# Altium project Function_generator.PrjPcb
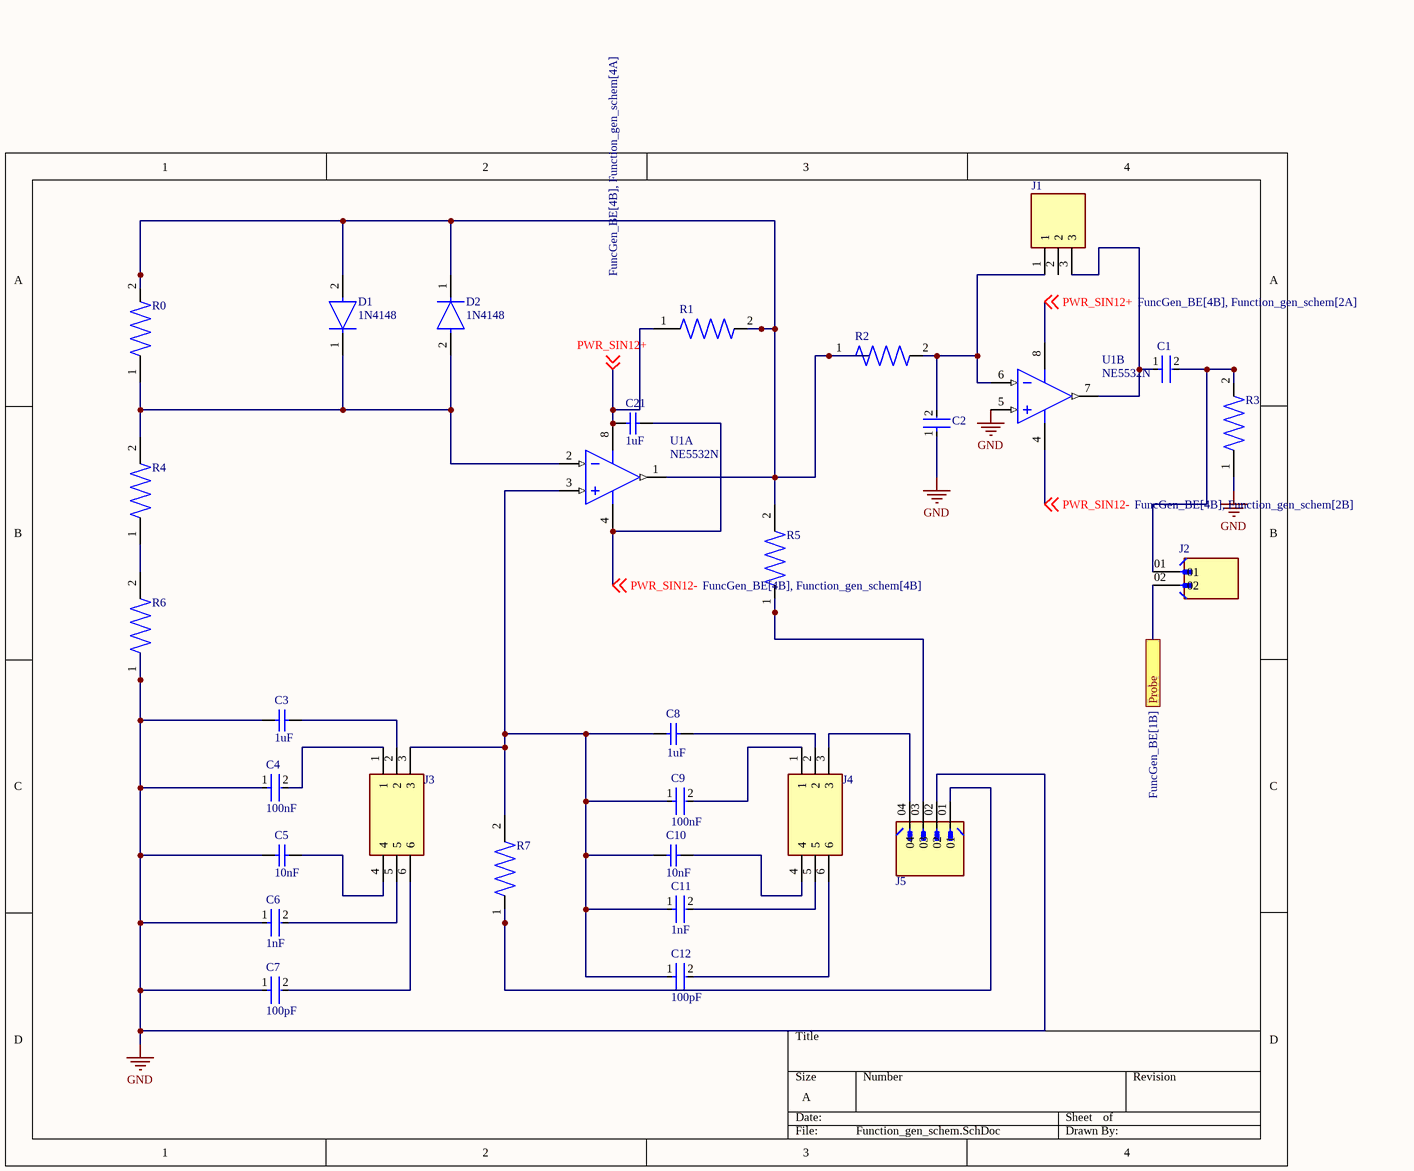
[diagram p0: Function_gen_schem.SchDoc]
3 sheets, 66 parts. Net scope: flat (ports and power ports of the same name join across sheets).
Board file: PCBLAST.PcbDoc
Sheets:
  Function_gen_schem.SchDoc
  FuncGen_ST.SchDoc
  FuncGen_BE.SchDoc

## Sheet Function_gen_schem.SchDoc
size A; SheetNumber: 1; SheetTotal: 3

### Parts
C1  SR205C104KAR  [FP-SR20-MFG]  (value not drawn)
C2  RCE5C1H271J0K1H03B  [FP-RCE0K1-MFG]  (value not drawn)
C3  1uF  [KEMT-C330C105M5U5TA]
C4  100nF  [FP-C322C104K5R5TA-MFG]
C5  10nF  [KEMT-C315-THT-2]
C6  1nF  [FP-DE6_D7_T7_F7_5_d0_6-0-MFG]
C7  100pF  [FP-RCE0K1-MFG]
C8  1uF  [KEMT-C330C105M5U5TA]
C9  100nF  [FP-C322C104K5R5TA-MFG]
C10  10nF  [KEMT-C315-THT-2]
C11  1nF  [FP-DE6_D7_T7_F7_5_d0_6-0-MFG]
C12  100pF  [FP-RCE0K1-MFG]
C21  1uF  [KEMT-C330C105M5U5TA]
D1  1N4148  [FP-017AG-MFG]
D2  1N4148  [FP-017AG-MFG]
J1  3-644456-3  [TE_3-644456-3]  (value not drawn)
J2  861400021YO2LF  [AMPHENOL_861400021YO2LF]  (value not drawn)
J3  4-103327-6  [TE_4-103327-6]  (value not drawn)
J4  4-103327-6  [TE_4-103327-6]  (value not drawn)
J5  77311-102S04LF  [AMPHENOL_77311-102S04LF]  (value not drawn)
R0  3-1623927-1  [RESAD700W45L350D185]  (value not drawn)
R1  3-1623927-1  [RESAD700W45L350D185]  (value not drawn)
R2  3-1623927-1  [RESAD700W45L350D185]  (value not drawn)
R3  3-1623927-1  [RESAD700W45L350D185]  (value not drawn)
R4  3-1623927-1  [RESAD700W45L350D185]  (value not drawn)
R5  3-1623927-1  [RESAD700W45L350D185]  (value not drawn)
R6  3-1623927-1  [RESAD700W45L350D185]  (value not drawn)
R7  3-1623927-1  [RESAD700W45L350D185]  (value not drawn)
U1  NE5532N  [ONSC-PDIP-8-626-05]  (parts A,B of 2)

### Ports
Probe (see FuncGen_BE[1B])

### Nets
GND: C2.1 C3.1 C4.1 C5.1 C6.1 C7.1 J5.02 R3.1 R6.1 U1.5(INB+)
PWR_SIN12+: C21.1 R1.1 U1.8(V+) ; off-sheet PWR_SIN12+
PWR_SIN12-: C21.2 U1.4(V-) ; off-sheet PWR_SIN12-
NetC1_1: C1.1 J1.3 U1.7(OUTB)
NetC1_2: C1.2 J2.01 R3.2
NetC2_2: C2.2 J1.1 R2.2 U1.6(INB-)
NetC3_2: C3.2 J3.2
NetC4_2: C4.2 J3.1
NetC5_2: C5.2 J3.4
NetC6_2: C6.2 J3.5
NetC7_2: C7.2 J3.6
NetC8_1: C8.1 C9.1 C10.1 C11.1 C12.1 J3.3 R7.2 U1.3(INA+)
NetC8_2: C8.2 J4.2
NetC9_2: C9.2 J4.1
NetC10_2: C10.2 J4.4
NetC11_2: C11.2 J4.5
NetC12_2: C12.2 J4.6
NetD1_1: D1.1(C) D2.2(A) R0.1 R4.2 U1.2(INA-)
NetD1_2: D1.2(A) D2.1(C) R0.2 R1.2 R2.1 R5.2 U1.1(OUTA)
NetJ2_02: J2.02 ; port Probe
NetJ4_3: J4.3 J5.04
NetJ5_01: J5.01 R7.1
NetJ5_03: J5.03 R5.1
NetR4_1: R4.1 R6.2

Not connected (* = marked no-connect by the designer): J1 2

### Library data of the parts
C1 = CMP-04427-000013-1: CAP CER 0.1UF 50V X7R RADIAL; Manufacturer: AVX; Material: Ceramic; Tolerance: 10%; Capacitance: 100nF; Value: 100nF; Voltage: 50V; Height: 5.08mm; Digikey Description: CAP CER 0.1UF 50V X7R RADIAL; Device Class L2: Capacitors; ComponentLink2URL: http://datasheets.avx.com/SR-Series.pdf; Temperature Range High: +125°C; Lead Free: Yes; Manufacturer Part Number: SR205C104KAR; Category: Cap; Device Class L1: Passive Components; Temperature: -55°C to +125°C; Voltage Rating: 50V; ComponentLink2Description: Datasheet; RoHS: TRUE; Automotive: No; Octopart: https://octopart.com/sr205c104kar-avx-145048; Mouser Description: Multilayer Ceramic Capacitors MLCC - Leaded 50volts 0.1uF 10% X7R; Temperature Characteristic: X7R; Device Class L3: Ceramic Capacitors; Temperature Range Low: -55°C; Package: SR20
C2 = CMP-06035-042310-1: Cap Ceramic 270pF 50V C0G ±5% Radial 5mm +125°C Automotive Bulk; Lead Diameter: 0.5mm; Lead/Base Style: Formed Leads; Height: 3.5mm; Max Operating Temperature: 125°C; Length: 0.142inch; Tolerance: 5%; Lead Pitch: 0.197inch; Mount: Through Hole; Width: 2.5mm; Dielectric: C0G; Packaging: Bulk; Voltage Rating: 50V; Resistor Type: Ceramic; Capacitance: 270pF; Case/Package: Radial; Height - Seated (Max): 0.138inch; Package Quantity: 500; Min Operating Temperature: -55°C; Voltage Rating (DC): 50V; Ratings: AEC-Q200; Termination: Radial
C3 C8 C21 = CMP-2000-06056-1: Ceramic Capacitor, 1 uF, +/- 20%, 50 V, -10 to 85 degC, 2-Pin THD, RoHS, Bulk; Manufacturer: Kemet; Voltage - Rated: 50V; Temperature Coefficient: Z5U; Catalog Drawings: C330(std); Product Training Modules: CapacitorBasics-TypicalUsesforCapacitors; Capacitance: 1µF; Online Catalog: GoldenMax™Series; Other Names: 399-4390; PCN Design/Specification: C3yySeriesGoldenMaxLeadConfiguration02/Feb/2015; Thickness (Max): -; Size / Dimension: 0.300"Lx0.150"W(7.62mmx3.81mm); Mounting Technology: ThroughHole; Tolerance: ±20%; Mounting Type: ThroughHole; Datasheet URL: http://www.kemet.com/Lists/ProductCatalog/Attachments/599/KEM_C1051_GOLDMAX_Z5U.pdf; Series: GoldenMax™; Standard Package: 250; Ratings: -; Applications: GeneralPurpose; Package Reference: C330C105M5U5TA; Packaging: Bulk; Category: Capacitors; Package Description: 2-Pin Through Hole Device, Body 7.11 x 4.07 mm; Operating Temperature: 10°C~85°C; Height - Seated (Max): 0.360"(9.14mm); Manufacturer URL: http://www.kemet.com/; Lead Spacing: 0.200"(5.08mm); Features: -; Lead Style: Straight; Package / Case: Radial; Family: CeramicCapacitors; Datasheet Version: 12/2015
C4 C9 = CMP-03020-034661-1: CAP CER 0.1UF 50V X7R RADIAL; Dielectric Material: Ceramic; Dissipation Factor: 2.5%; Lead Length: 7mm; Tolerance: 10%; Lead Diameter: 0.51mm; Lead/Base Style: Formed Leads; Capacitance: 100nF; Construction: RADIAL; RoHS Compliant: Yes; Voltage Rating (DC): 50V; Packaging: Bulk; Lead Free: Lead Free; Width: 0.125inch; Lead Pitch: 5.08mm; Voltage Rating: 50V; Number of Pins: 2; Radiation Hardening: No; Material: Ceramic; REACH SVHC: No SVHC; Height - Seated (Max): 0.26inch; Case/Package: Radial; Weight: 0.0625lb; Dielectric: X7R; Min Operating Temperature: -55°C; Voltage: 50V; Series: Golden Max™; Max Operating Temperature: 125°C; Height: 3.18mm; Termination: Radial; Length: 5.08mm; Depth: 3.18mm; Package Quantity: 500; Mount: Through Hole
C5 C10 = CMP-1664-00007-1: Capacitor, Ceramic, 0.01 uF, +/- 10%, 100 V, X7R, -55 to 125 degC, 2-Pin THD, RoHS, Bulk; Output Voltage: 70 V; Case\Package: PDIP; Forward Current: 60 mA; Nominal Vf: 1.3 V; Forward Voltage: 1.5 V; Channels: 2; Max Power Dissipation: 400 mW; Vce Max: 500 mV; ComponentLink1Description: Manufacturer URL; ComponentLink2Description: Datasheet; Packaging: Rail/Tube; RoHSCompliant: true; Package Quantity: 2000; PackageReference: C315-THT-2; Min Operating Temperature: -55 degC; Max Operating Temperature: 100 degC; Radiation Hardening: No; ComponentLink1URL: http://www.kemet.com/; DatasheetVersion: Aug-16; Pins: 16; PackageDescription: 2-Pin Through Hole Device, Body 3.81 x 2.54 mm; REACH SVHC: Unknown; Mount: Through Hole; ComponentLink2URL: http://capacitoredge.kemet.com/capedge2/DataSheet/Datasheet-C315C103K1R5TA.pdf?pn=C315C103K1R5TA{BULK}
C6 C11 = CMP-06035-062244-1: CAP CER 1000PF 300VAC RADIAL; Lead/Base Style: Formed Leads; Material: Ceramic; Tolerance: 20%; Lead Diameter: 0.6mm; Voltage Rating (AC): 300V; Termination: Radial; RoHS Compliant: Yes; Width: 7mm; Package Quantity: 700; Lead Pitch: 7.5mm; Capacitance: 1nF; Case/Package: Radial; Resistor Type: Ceramic; Ratings: AEC-Q200; Series: KJ; Depth: 7mm; Min Operating Temperature: -25°C; Height - Seated (Max): 0.394inch; Mount: Through Hole; REACH SVHC: No SVHC; Max Operating Temperature: 125°C; Packaging: Bulk
C7 C12 = CMP-06035-040252-1: Cap Ceramic 100pF 50V C0G ±5% Radial 5mm +125°C Automotive Bulk; Lead Diameter: 0.5mm; Lead/Base Style: Formed Leads; Mount: Through Hole; Height: 3.5mm; Voltage Rating: 50V; Lead Pitch: 0.197inch; Packaging: Bulk; Capacitance: 100pF; Height - Seated (Max): 0.138inch; Length: 0.142inch; Max Operating Temperature: 125°C; Resistor Type: Ceramic; Case/Package: Radial; Package Quantity: 500; Voltage Rating (DC): 50V; Tolerance: 5%; Width: 2.5mm; Termination: Radial; Ratings: AEC-Q200; Dielectric: C0G; Min Operating Temperature: -55°C
D1 D2 = CMP-07163-000046-1: DIODE GEN PURP 100V 200MA DO35; Forward Voltage: 1V; Max Power Dissipation: 500mW; Max Reverse Current: 5uA; Forward Current: 300mA; Current: 4A; Reverse Recovery Time: 4ns; Element Configuration: Single; Outside Diameter: 1.85mm; Capacitance: 4pF; Polarity: Standard; Max Forward Surge Current (Ifsm): 1A; Reverse Voltage: 100V; Output Current: 200mA; Average Rectified Current: 200mA; Diameter: 1.91mm; Max Repetitive Reverse Voltage (Vrrm): 100V; Current Rating: 200mA; Case/Package: DO-35; Lead Free: Lead Free; Number of Pins: 2; Recovery Time: 4ns; Packaging: Bulk; Contact Plating: Tin; Voltage: 100V; Mount: Through Hole; Max Surge Current: 4A; Package Quantity: 2000; Width: 1.91mm; Max Reverse Voltage (DC): 100V; Length: 4.56mm; Radiation Hardening: No; Power Dissipation: 500mW; Voltage Rating (DC): 100V; Peak Non-Repetitive Surge Current: 4A; REACH SVHC: No SVHC; Height: 4.56mm; Max Operating Temperature: 175°C; Series: -; Weight: 0.01lb; Min Operating Temperature: -65°C
J1 = 3-644456-3: MTA-100 3 Position Through-Hole Single Row Straight Wire to Board Header; Centerline_Pitch: 2.54 mm[.1 in]; Product_Type: Connector; MF: TE Connectivity; Number_of_Positions: 3; MP: 3-644456-3; Price: None; Package: None; Availability: Unavailable; SnapEDA_Link: https://www.snapeda.com/parts/3-644456-3/TE%20Connectivity%20AMP%20Connectors/view-part/2772999/?ref=snap; Value: *; TE_purchase_URL: https://www.te.com/usa-en/product-3-644456-3.html?te_bu=Cor&te_type=disp&te_campaign=seda_glo_cor-seda-global-disp-prtnr-fy19-seda-model-bom-cta_sma-317_1&elqCampaignId=32493
J2 = 861400021YO2LF: Board to Board connector, Unshrouded Header, Through Hole, Single Row, 2 Position, Vertical.; MF: Amphenol ICC (FCI); Value: *; SnapEDA_Link: https://www.snapeda.com/parts/861400021YO2LF/Amphenol+FCI/view-part/?ref=snap; Purchase-URL: https://pricing.snapeda.com/search/part/861400021YO2LF/?ref=eda; Availability: In Stock; Price: None; Package: None; Check_prices: https://www.snapeda.com/parts/861400021YO2LF/Amphenol+FCI/view-part/?ref=eda; MP: 861400021YO2LF
J3 J4 = 4-103327-6: 6 Position Single Row 2.54 mm Through-Hole Straight AMPMODU Breakaway Header; Centerline_Pitch: 2.54 mm[.1 in]; MF: TE Connectivity; Product_Type: Connector; Number_of_Positions: 6; SnapEDA_Link: https://www.snapeda.com/parts/4-103327-6/TE%20Connectivity%20AMP%20Connectors/view-part/2779147/?ref=snap; TE_purchase_URL: https://www.te.com/usa-en/product-4-103327-6.html?te_bu=Cor&te_type=disp&te_campaign=seda_glo_cor-seda-global-disp-prtnr-fy19-seda-model-bom-cta_sma-317_1&elqCampaignId=32493; Availability: Unavailable; Price: None; MP: 4-103327-6; Package: None; Value: *
J5 = 77311-102S04LF: BergStikÂ® 2.54mm, Board To Board, Unshrouded Header, 2.54 mm Pitch, Vertical, Single Row,Through Hole, 4 positions.; MF: Amphenol ICC (FCI); Purchase-URL: https://pricing.snapeda.com/search/part/77311-102S04LF/?ref=eda; Package: None; Value: *; Check_prices: https://www.snapeda.com/parts/77311-102S04LF/Amphenol+FCI/view-part/?ref=eda; SnapEDA_Link: https://www.snapeda.com/parts/77311-102S04LF/Amphenol+FCI/view-part/?ref=snap; Availability: In Stock; Price: None; MP: 77311-102S04LF
R0-R7 = 3-1623927-1: 1 MOhms Â±5% 0.25W, 1/4W Through Hole Resistor Axial - Carbon Film; MF: TE Connectivity; Price: None; SnapEDA_Link: https://www.snapeda.com/parts/3-1623927-1/TE+Connectivity/view-part/?ref=snap; Check_prices: https://www.snapeda.com/parts/3-1623927-1/TE+Connectivity/view-part/?ref=eda; Value: *; MP: 3-1623927-1; Package: None; Availability: In Stock
U1 = CMP-1310-00070-1: Internally Compensated Dual Low Noise Operational Amplifier, 6 to 40 V, 0 to 70 degC, 8-Pin PDIP, Tube; Manufacturer: On Semiconductor; VCC Min (V): 6; VCC Max (V): 40; GBW Typ (MHz): 10; SR Typ (V/uS): 9; Mounting Technology: Through Hole; PackageVersion: Rev. N, 06/2013; PartNumber: NE5532N; PackageDescription: 8-Pin Plastic Dual-In Line Package, Body 9.59 x 6.605 mm, Pitch 2.54 mm; ComponentLink3URL: http://www.onsemi.cn/pub_link/Collateral/626-05.PDF; PackageReference: PDIP-8-626-05; ComponentLink2Description: Datasheet; ComponentLink3Description: Package Specification; RoHS: FALSE; ComponentLink1URL: http://www.onsemi.com/; ComponentLink1Description: Manufacturer URL; ComponentLink2URL: http://www.onsemi.cn/pub_link/Collateral/NE5532-D.PDF; Packing: Tube; DatasheetVersion: Rev. 2

## Sheet FuncGen_ST.SchDoc
size A; SheetNumber: 2; SheetTotal: 3
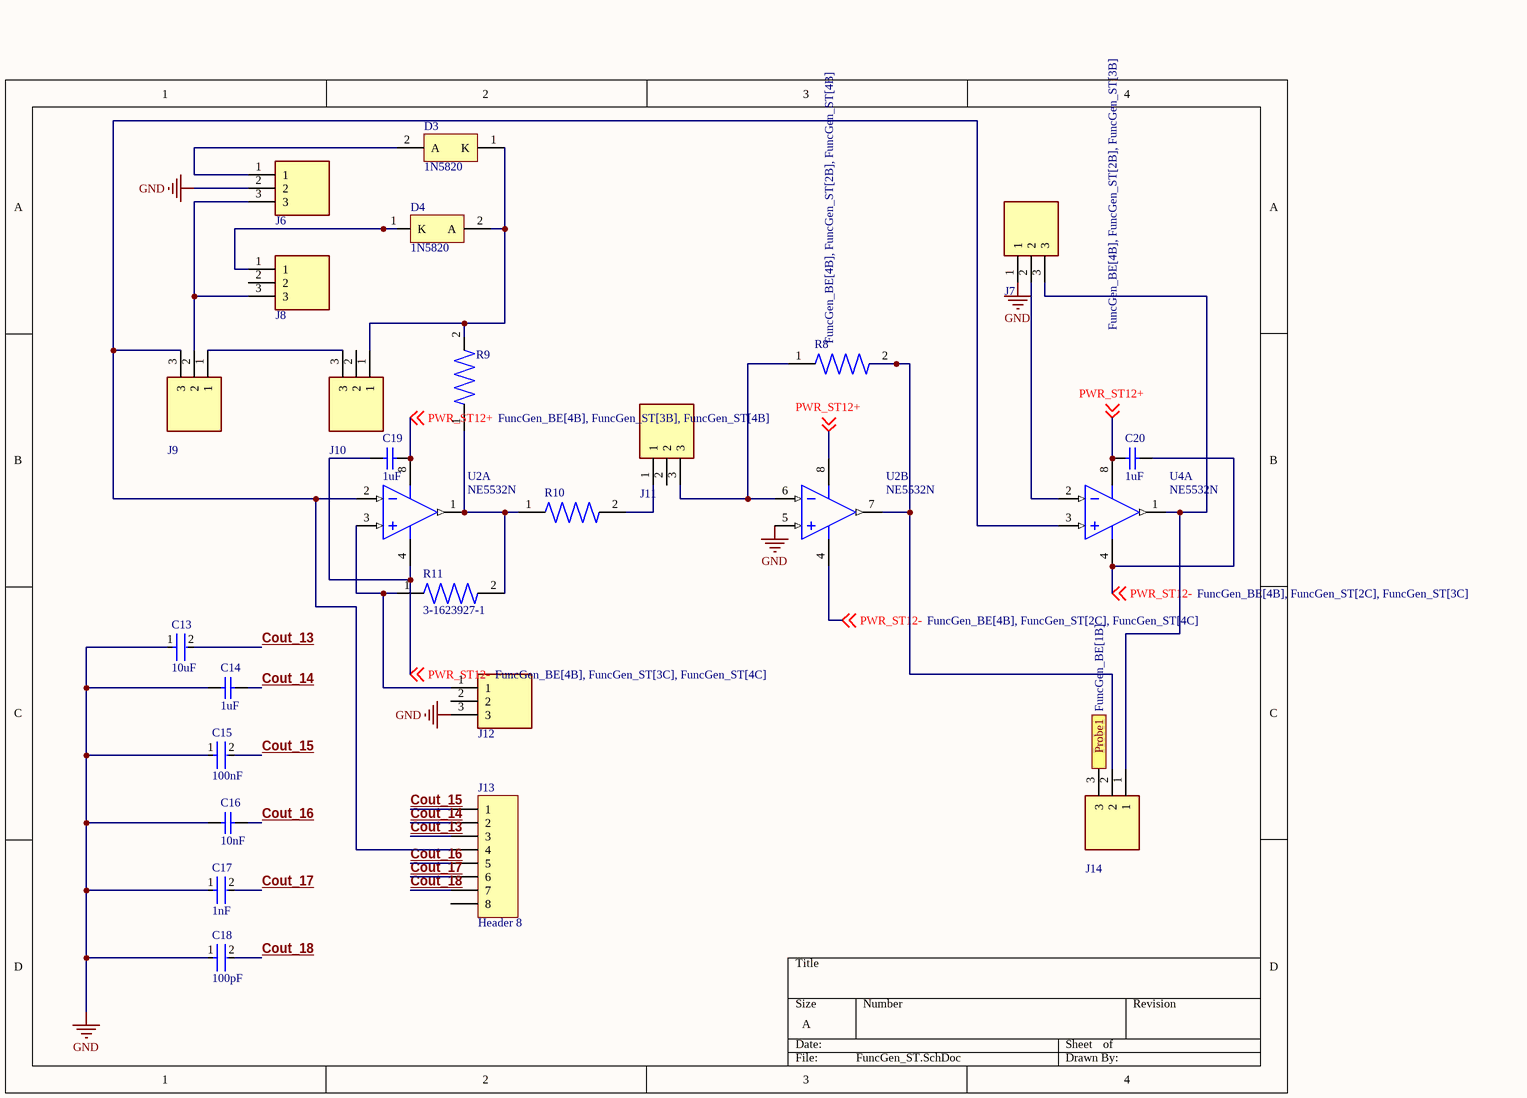
[diagram p1: FuncGen_ST.SchDoc]

### Parts
C13  10uF  [FP-RCE3M1-MFG]
C14  1uF  [KEMT-C330C105M5U5TA]
C15  100nF  [FP-C322C104K5R5TA-MFG]
C16  10nF  [KEMT-C315-THT-2]
C17  1nF  [FP-DE6_D7_T7_F7_5_d0_6-0-MFG]
C18  100pF  [FP-RCE0K1-MFG]
C19  1uF  [KEMT-C330C105M5U5TA]
C20  1uF  [KEMT-C330C105M5U5TA]
D3  1N5820  [ONSC-AXIAL_LEAD-2-267-05_V]
D4  1N5820  [ONSC-AXIAL_LEAD-2-267-05_V]
J6  3-644456-3  [TE_3-644456-3]  (value not drawn)
J7  3-644456-3  [TE_3-644456-3]  (value not drawn)
J8  3-644456-3  [TE_3-644456-3]  (value not drawn)
J9  3-644456-3  [TE_3-644456-3]  (value not drawn)
J10  3-644456-3  [TE_3-644456-3]  (value not drawn)
J11  3-644456-3  [TE_3-644456-3]  (value not drawn)
J12  3-644456-3  [TE_3-644456-3]  (value not drawn)
J13  Header 8  [HDR1X8]
J14  3-644456-3  [TE_3-644456-3]  (value not drawn)
R8  3-1623927-1  [RESAD700W45L350D185]  (value not drawn)
R9  3-1623927-1  [RESAD700W45L350D185]  (value not drawn)
R10  3-1623927-1  [RESAD700W45L350D185]  (value not drawn)
R11  3-1623927-1  [RESAD700W45L350D185]
U2  NE5532N  [ONSC-PDIP-8-626-05]  (parts A,B of 2)
U4  NE5532N  [ONSC-PDIP-8-626-05]  (part A of 2)

### Ports
Probe1 (see FuncGen_BE[1B])

### Nets
GND: C13.1 C14.1 C15.1 C16.1 C17.1 C18.1 J6.2 J7.1 J12.3 U2.5(INB+)
Cout_13: C13.2 J13.3
Cout_14: C14.2 J13.2
Cout_15: C15.2 J13.1
Cout_16: C16.2 J13.5
Cout_17: C17.2 J13.6
Cout_18: C18.2 J13.7
PWR_ST12+: C19.2 C20.1 U2.8(V+) U4.8(V+) ; off-sheet PWR_ST12+
PWR_ST12-: C19.1 C20.2 U2.4(V-) U4.4(V-) ; off-sheet PWR_ST12-
NetD3_1: D3.1(K) D4.2(A) J10.1 R9.2
NetD3_2: D3.2(A) J6.1
NetD4_1: D4.1(K) J8.1
NetJ2_02: J14.3 ; port Probe1
NetJ6_3: J6.3 J8.3 J9.2
NetJ7_2: J7.2 U4.2(INA-)
NetJ7_3: J7.3 J14.1 U4.1(OUTA)
NetJ9_1: J9.1 J10.3
NetJ9_3: J9.3 J13.4 U2.2(INA-) U4.3(INA+)
NetJ11_1: J11.1 R10.2
NetJ11_3: J11.3 R8.1 U2.6(INB-)
NetJ12_1: J12.1 R11.1 U2.3(INA+)
NetJ14_2: J14.2 R8.2 U2.7(OUTB)
NetR9_1: R9.1 R10.1 R11.2 U2.1(OUTA)

Not connected (* = marked no-connect by the designer): J8 2; J10 2; J11 2; J12 2; J13 8

### Library data of the parts
C13 = CMP-06035-005744-1: Cap Ceramic 10uF 25V X7R ±10% Radial 5mm +125°C Automotive Ammo Pack; Lead/Base Style: Formed Leads; Lead Diameter: 0.5mm; Length: 0.217inch; Package Quantity: 1500; Width: 0.157inch; Resistor Type: Ceramic; Height - Seated (Max): 0.197inch; Ratings: AEC-Q200; Lead Pitch: 0.197inch; Packaging: Tape and Reel; Tolerance: 10%; Voltage Rating (DC): 25V; Capacitance: 10uF; Termination: Radial; Mount: Through Hole; Voltage Rating: 25V; Min Operating Temperature: -55°C; Height: 5mm; Dielectric: X7R; Max Operating Temperature: 125°C; Case/Package: Radial
C14 C19 C20 = CMP-2000-06056-1: as C3 on sheet Function_gen_schem; Thickness (Max): -; Size / Dimension: 0.300"Lx0.150"W(7.62mmx3.81mm); Mounting Technology: ThroughHole; Tolerance: ±20%; Mounting Type: ThroughHole; Datasheet URL: http://www.kemet.com/Lists/ProductCatalog/Attachments/599/KEM_C1051_GOLDMAX_Z5U.pdf; Series: GoldenMax™; Standard Package: 250; Ratings: -; Applications: GeneralPurpose; Package Reference: C330C105M5U5TA; Packaging: Bulk; Category: Capacitors; Package Description: 2-Pin Through Hole Device, Body 7.11 x 4.07 mm; Operating Temperature: 10°C~85°C; Height - Seated (Max): 0.360"(9.14mm); Manufacturer URL: http://www.kemet.com/; Lead Spacing: 0.200"(5.08mm); Features: -; Lead Style: Straight; Package / Case: Radial; Family: CeramicCapacitors; Datasheet Version: 12/2015
C15 = CMP-03020-034661-1: as C4 on sheet Function_gen_schem; Capacitance: 100nF; Construction: RADIAL; RoHS Compliant: Yes; Voltage Rating (DC): 50V; Packaging: Bulk; Lead Free: Lead Free; Width: 0.125inch; Lead Pitch: 5.08mm; Voltage Rating: 50V; Number of Pins: 2; Radiation Hardening: No; Material: Ceramic; REACH SVHC: No SVHC; Height - Seated (Max): 0.26inch; Case/Package: Radial; Weight: 0.0625lb; Dielectric: X7R; Min Operating Temperature: -55°C; Voltage: 50V; Series: Golden Max™; Max Operating Temperature: 125°C; Height: 3.18mm; Termination: Radial; Length: 5.08mm; Depth: 3.18mm; Package Quantity: 500; Mount: Through Hole
C16 = CMP-1664-00007-1: as C5 on sheet Function_gen_schem; ComponentLink1Description: Manufacturer URL; ComponentLink2Description: Datasheet; Packaging: Rail/Tube; RoHSCompliant: true; Package Quantity: 2000; PackageReference: C315-THT-2; Min Operating Temperature: -55 degC; Max Operating Temperature: 100 degC; Radiation Hardening: No; ComponentLink1URL: http://www.kemet.com/; DatasheetVersion: Aug-16; Pins: 16; PackageDescription: 2-Pin Through Hole Device, Body 3.81 x 2.54 mm; REACH SVHC: Unknown; Mount: Through Hole; ComponentLink2URL: http://capacitoredge.kemet.com/capedge2/DataSheet/Datasheet-C315C103K1R5TA.pdf?pn=C315C103K1R5TA{BULK}
C17 = CMP-06035-062244-1: as C6 on sheet Function_gen_schem; Termination: Radial; RoHS Compliant: Yes; Width: 7mm; Package Quantity: 700; Lead Pitch: 7.5mm; Capacitance: 1nF; Case/Package: Radial; Resistor Type: Ceramic; Ratings: AEC-Q200; Series: KJ; Depth: 7mm; Min Operating Temperature: -25°C; Height - Seated (Max): 0.394inch; Mount: Through Hole; REACH SVHC: No SVHC; Max Operating Temperature: 125°C; Packaging: Bulk
C18 = CMP-06035-040252-1: as C7 on sheet Function_gen_schem; Mount: Through Hole; Height: 3.5mm; Voltage Rating: 50V; Lead Pitch: 0.197inch; Packaging: Bulk; Capacitance: 100pF; Height - Seated (Max): 0.138inch; Length: 0.142inch; Max Operating Temperature: 125°C; Resistor Type: Ceramic; Case/Package: Radial; Package Quantity: 500; Voltage Rating (DC): 50V; Tolerance: 5%; Width: 2.5mm; Termination: Radial; Ratings: AEC-Q200; Dielectric: C0G; Min Operating Temperature: -55°C
D3 D4 = CMP-1055-00030-1: Rectifier, 2-Pin Axial_Lead, Bulk Bag; Manufacturer: On Semiconductor; Note1: 0; IFSM Max (A): 80; Configuration: Single; PackageReference: AXIAL_LEAD-2-267-05; ComponentLink3URL: http://www.onsemi.com/pub_link/Collateral/267-05.PDF; ComponentLink1Description: Manufacturer URL; PartNumber: 1N5820; ComponentLink2URL: http://www.onsemi.cn/pub_link/Collateral/1N5820-D.PDF; DatasheetVersion: Rev. 10; PackageVersion: Rev. G, 06/2000; ComponentLink2Description: Datasheet; Packing: Bulk Bag; PackageDescription: 2-Pin, Axial Lead, Diameter 5.05 mm; Mounting Technology: Through Hole; ComponentLink1URL: http://www.onsemi.com/; ComponentLink3Description: Package Specification; RoHS: FALSE
J6-J12 J14 = 3-644456-3: as J1 on sheet Function_gen_schem; MP: 3-644456-3; Price: None; Package: None; Availability: Unavailable; SnapEDA_Link: https://www.snapeda.com/parts/3-644456-3/TE%20Connectivity%20AMP%20Connectors/view-part/2772999/?ref=snap; Value: *; TE_purchase_URL: https://www.te.com/usa-en/product-3-644456-3.html?te_bu=Cor&te_type=disp&te_campaign=seda_glo_cor-seda-global-disp-prtnr-fy19-seda-model-bom-cta_sma-317_1&elqCampaignId=32493
J13 = Header 8: Header, 8-Pin; LatestRevisionDate: 17-Jul-2002; LatestRevisionNote: Re-released for DXP Platform.; Publisher: Altium Limited
R8-R11 = 3-1623927-1: as R0 on sheet Function_gen_schem; Price: None; SnapEDA_Link: https://www.snapeda.com/parts/3-1623927-1/TE+Connectivity/view-part/?ref=snap; Check_prices: https://www.snapeda.com/parts/3-1623927-1/TE+Connectivity/view-part/?ref=eda; Value: *; MP: 3-1623927-1; Package: None; Availability: In Stock
U2 U4 = CMP-1310-00070-1: as U1 on sheet Function_gen_schem; Mounting Technology: Through Hole; PackageVersion: Rev. N, 06/2013; PartNumber: NE5532N; PackageDescription: 8-Pin Plastic Dual-In Line Package, Body 9.59 x 6.605 mm, Pitch 2.54 mm; ComponentLink3URL: http://www.onsemi.cn/pub_link/Collateral/626-05.PDF; PackageReference: PDIP-8-626-05; ComponentLink2Description: Datasheet; ComponentLink3Description: Package Specification; RoHS: FALSE; ComponentLink1URL: http://www.onsemi.com/; ComponentLink1Description: Manufacturer URL; ComponentLink2URL: http://www.onsemi.cn/pub_link/Collateral/NE5532-D.PDF; Packing: Tube; DatasheetVersion: Rev. 2

## Sheet FuncGen_BE.SchDoc
size A; SheetNumber: 3; SheetTotal: 3
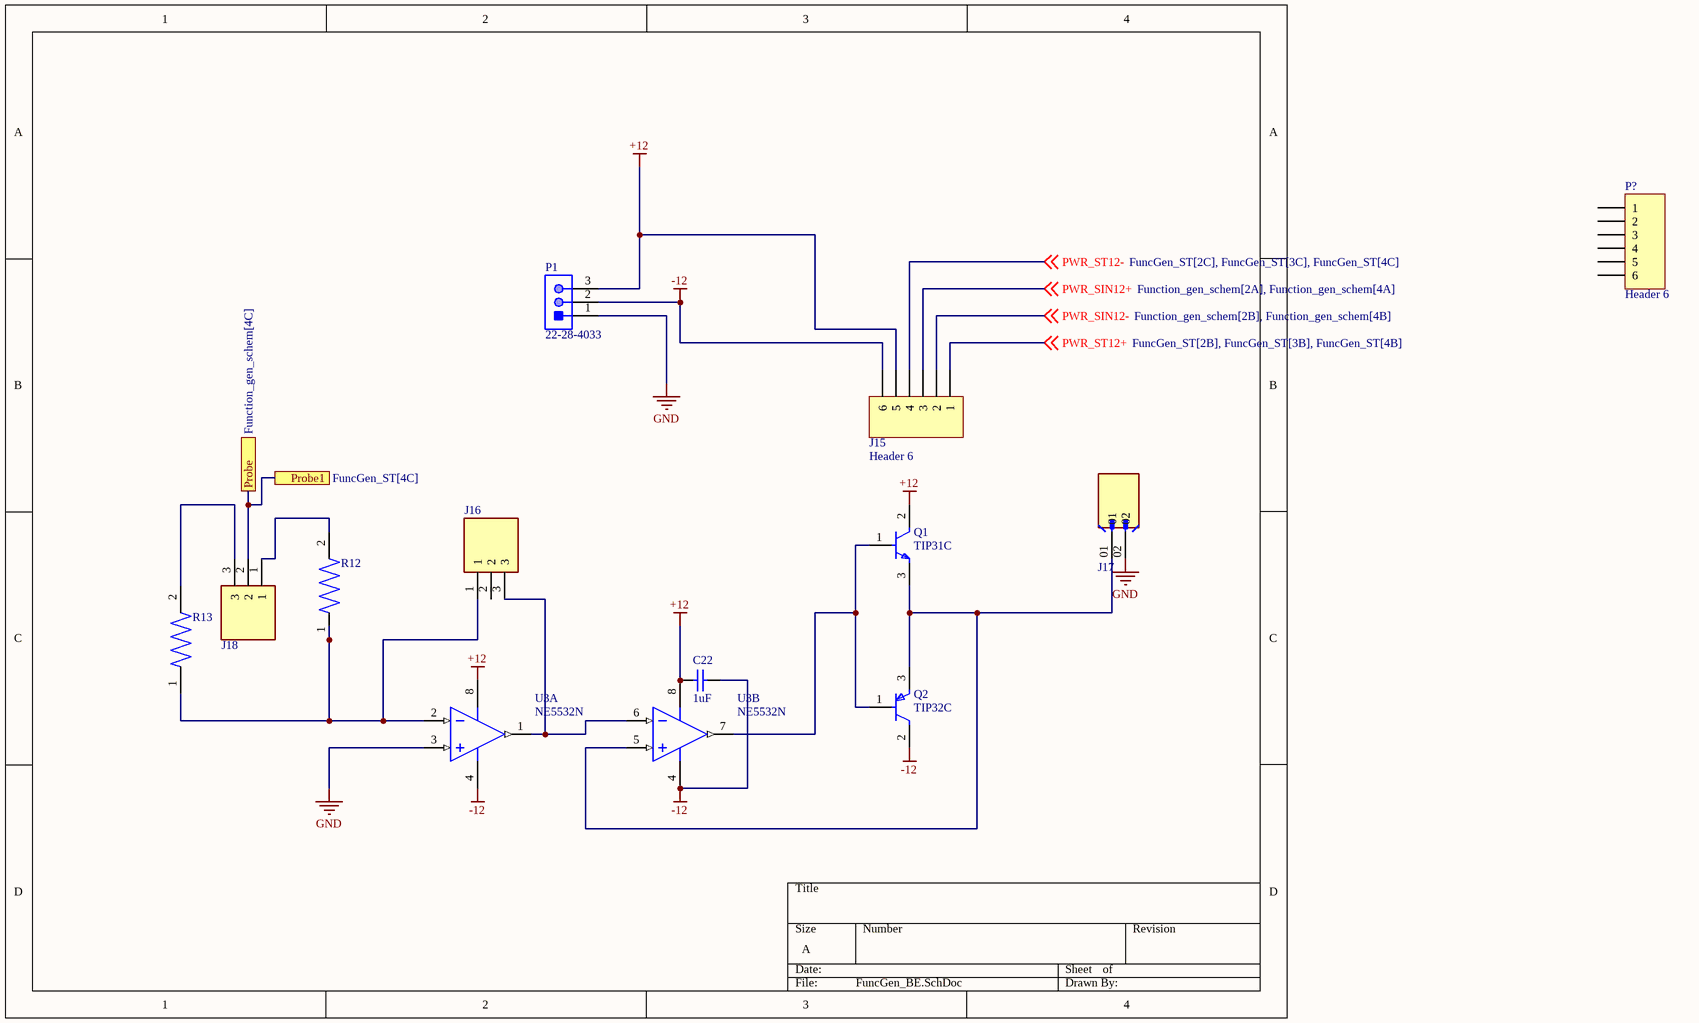
[diagram p2: FuncGen_BE.SchDoc]

### Parts
C22  1uF  [KEMT-C330C105M5U5TA]
J15  Header 6  [HDR1X6]
J16  3-644456-3  [TE_3-644456-3]  (value not drawn)
J17  861400021YO2LF_SWITCH  [AMPHENOL_861400021YO2LF]  (value not drawn)
J18  3-644456-3  [TE_3-644456-3]  (value not drawn)
P1  22-28-4033  [MOLX-22-28-4033_V]
P?  Header 6  [HDR1X6]
Q1  TIP31C  [FP-TO-220-P0A0015988-MFG]
Q2  TIP32C  [FP-TO-220-P0A0015988-MFG]
R12  3-1623927-1  [RESAD700W45L350D185]  (value not drawn)
R13  3-1623927-1  [RESAD700W45L350D185]  (value not drawn)
U3  NE5532N  [ONSC-PDIP-8-626-05]  (parts A,B of 2)

### Ports
Probe1 (see FuncGen_ST[4C]), Probe (see Function_gen_schem[4C])

### Nets
+12: C22.1 J15.5 P1.3 Q1.2(C) U3.8(V+)
-12: C22.2 J15.6 P1.2 Q2.2(C) U3.4(V-)
GND: J17.02 P1.1 U3.3(INA+)
PWR_SIN12+: J15.3 ; off-sheet PWR_SIN12+
PWR_SIN12-: J15.2 ; off-sheet PWR_SIN12-
PWR_ST12+: J15.1 ; off-sheet PWR_ST12+
PWR_ST12-: J15.4 ; off-sheet PWR_ST12-
NetJ2_02: J18.2 ; port Probe, port Probe1
NetJ16_1: J16.1 R12.1 R13.1 U3.2(INA-)
NetJ16_3: J16.3 U3.1(OUTA) U3.6(INB-)
NetJ17_01: J17.01 Q1.3(E) Q2.3(E) U3.5(INB+)
NetJ18_1: J18.1 R12.2
NetJ18_3: J18.3 R13.2
NetQ1_1: Q1.1(B) Q2.1(B) U3.7(OUTB)

Not connected (* = marked no-connect by the designer): J16 2; P? 1 2 3 4 5 6

### Library data of the parts
C22 = CMP-2000-06056-1: as C3 on sheet Function_gen_schem; Thickness (Max): -; Size / Dimension: 0.300"Lx0.150"W(7.62mmx3.81mm); Mounting Technology: ThroughHole; Tolerance: ±20%; Mounting Type: ThroughHole; Datasheet URL: http://www.kemet.com/Lists/ProductCatalog/Attachments/599/KEM_C1051_GOLDMAX_Z5U.pdf; Series: GoldenMax™; Standard Package: 250; Ratings: -; Applications: GeneralPurpose; Package Reference: C330C105M5U5TA; Packaging: Bulk; Category: Capacitors; Package Description: 2-Pin Through Hole Device, Body 7.11 x 4.07 mm; Operating Temperature: 10°C~85°C; Height - Seated (Max): 0.360"(9.14mm); Manufacturer URL: http://www.kemet.com/; Lead Spacing: 0.200"(5.08mm); Features: -; Lead Style: Straight; Package / Case: Radial; Family: CeramicCapacitors; Datasheet Version: 12/2015
J15 P? = Header 6: Header, 6-Pin; LatestRevisionDate: 17-Jul-2002; LatestRevisionNote: Re-released for DXP Platform.; Publisher: Altium Limited
J16 J18 = 3-644456-3: as J1 on sheet Function_gen_schem; MP: 3-644456-3; Price: None; Package: None; Availability: Unavailable; SnapEDA_Link: https://www.snapeda.com/parts/3-644456-3/TE%20Connectivity%20AMP%20Connectors/view-part/2772999/?ref=snap; Value: *; TE_purchase_URL: https://www.te.com/usa-en/product-3-644456-3.html?te_bu=Cor&te_type=disp&te_campaign=seda_glo_cor-seda-global-disp-prtnr-fy19-seda-model-bom-cta_sma-317_1&elqCampaignId=32493
J17 = 861400021YO2LF: as J2 on sheet Function_gen_schem; Value: *; SnapEDA_Link: https://www.snapeda.com/parts/861400021YO2LF/Amphenol+FCI/view-part/?ref=snap; Purchase-URL: https://pricing.snapeda.com/search/part/861400021YO2LF/?ref=eda; Availability: In Stock; Price: None; Package: None; Check_prices: https://www.snapeda.com/parts/861400021YO2LF/Amphenol+FCI/view-part/?ref=eda; MP: 861400021YO2LF
P1 = CMP-1676-00001-5: Male Header, Pitch 2.54 mm, 1 x 3 Position, Height 8.38 mm, Tail Length 3.18 mm, RoHS, Bulk; Manufacturer: Molex; Rows: 1; Voltage Rating: 250 V; Current Rating: 4 A; Min Operating Temperature: 0 degC; Lead Pitch: 0.1 inch; Packaging: Bulk; Contact Finish: Gold; RoHSCompliant: true; Contact Material: Brass; PackageReference: 22-28-4033; REACH SVHC: Unknown; PackageDescription: Male Header, Pitch 2.54 mm, 1 x 3 Position, Height 8.38 mm, Tail Length 3.18 mm; ComponentLink2URL: http://www.molex.com/pdm_docs/sd/022284033_sd.pdf; Height: 8.38 mm; Mounting Technology: Through Hole; ComponentLink1Description: Manufacturer URL; Length: 7.62 mm; Mount: Through Hole; DatasheetVersion: Rev. G, 01/2012; Max Operating Temperature: 75 degC; ComponentLink2Description: Datasheet; Colour: Black; Pins: 3; Contact Plating: Gold; Package Quantity: 1; ComponentLink1URL: http://www.molex.com/
Q1 = CMP-12195-000001-1: TRANS NPN 100V 3A TO-220; Manufacturer: STMicroelectronics; Hfe Max: 50; Number Of Npn: 1; Max Junction Temp: +150°C; Standoff Height: 3.5mm; Emitter Base Voltage: 5V; Collector Emitter Saturation Voltage: 1.2V; Power Dissipation: 2W; Hfe Testvce: 4V; Hfe Min: 10; Device Class L2: Transistors; ComponentLink2URL: https://www.st.com/resource/en/datasheet/tip31c.pdf; Device Class L1: Discrete Semiconductors; Digikey Description: TRANS NPN 100V 3A TO-220; Max Collector Current: 3A; RoHS: TRUE; Height: 19.68mm; Mouser Description: Bipolar Transistors - BJT NPN Gen Pur Power; Number Of Elements: 1; Package: TO-220-P0A0015988; Temperature: to +150°C; Octopart: https://octopart.com/tip31c-stmicroelectronics-15555; Manufacturer Part Number: TIP31C; Category: Trans; Hfe Testic: 3A; Lead Free: Yes; Collector Base Voltage: 100V; Device Class L3: BJTs; Collector Emitter Voltage: 100V; Automotive: No; ComponentLink2Description: Datasheet; Temperature Range High: +150°C
Q2 = CMP-12195-000005-1: TRANS PNP 100V 3A TO-220; Manufacturer: STMicroelectronics; Standoff Height: 3.5mm; Number Of Pnp: 1; Max Collector Current: -3A; Emitter Base Voltage: -5V; Collector Emitter Voltage: -100V; Hfe Testvce: -4V; Hfe Max: 50; Collector Emitter Saturation Voltage: -1.2V; Power Dissipation: 2W; Max Junction Temp: +150°C; Hfe Min: 10; Device Class L3: BJTs; Mouser Description: Original ST Microelectronics Transistor, 100V, 3A, .22 Ohm, TO-220 Package; ComponentLink2Description: Datasheet; Device Class L1: Discrete Semiconductors; Automotive: No; Number Of Elements: 1; Category: Trans; Collector Base Voltage: -100V; Package: TO-220-P0A0015988; Height: 19.68mm; Lead Free: Yes; ComponentLink2URL: https://www.st.com/resource/en/datasheet/tip32c.pdf; Hfe Testic: -3A; RoHS: TRUE; Temperature Range High: +150°C; Temperature: to +150°C; Device Class L2: Transistors; Digikey Description: TRANS PNP 100V 3A TO-220; Octopart: https://octopart.com/tip32c-stmicroelectronics-353617; Manufacturer Part Number: TIP32C
R12 R13 = 3-1623927-1: as R0 on sheet Function_gen_schem; Price: None; SnapEDA_Link: https://www.snapeda.com/parts/3-1623927-1/TE+Connectivity/view-part/?ref=snap; Check_prices: https://www.snapeda.com/parts/3-1623927-1/TE+Connectivity/view-part/?ref=eda; Value: *; MP: 3-1623927-1; Package: None; Availability: In Stock
U3 = CMP-1310-00070-1: as U1 on sheet Function_gen_schem; Mounting Technology: Through Hole; PackageVersion: Rev. N, 06/2013; PartNumber: NE5532N; PackageDescription: 8-Pin Plastic Dual-In Line Package, Body 9.59 x 6.605 mm, Pitch 2.54 mm; ComponentLink3URL: http://www.onsemi.cn/pub_link/Collateral/626-05.PDF; PackageReference: PDIP-8-626-05; ComponentLink2Description: Datasheet; ComponentLink3Description: Package Specification; RoHS: FALSE; ComponentLink1URL: http://www.onsemi.com/; ComponentLink1Description: Manufacturer URL; ComponentLink2URL: http://www.onsemi.cn/pub_link/Collateral/NE5532-D.PDF; Packing: Tube; DatasheetVersion: Rev. 2

## Nets that join several sheets
GND: Function_gen_schem (10 pins), FuncGen_ST (10 pins), FuncGen_BE (J17.02 P1.1 U3.3)
NetJ2_02: Function_gen_schem (J2.02), FuncGen_ST (J14.3), FuncGen_BE (J18.2)
PWR_SIN12+: Function_gen_schem (C21.1 R1.1 U1.8), FuncGen_BE (J15.3)
PWR_SIN12-: Function_gen_schem (C21.2 U1.4), FuncGen_BE (J15.2)
PWR_ST12+: FuncGen_ST (C19.2 C20.1 U2.8 U4.8), FuncGen_BE (J15.1)
PWR_ST12-: FuncGen_ST (C19.1 C20.2 U2.4 U4.4), FuncGen_BE (J15.4)